# Altium schematic sheet Battery-Charger.SchDoc
size A4; DrawnBy: UGUR KELES; SheetNumber: 2; SheetTotal: 4; Size: A4
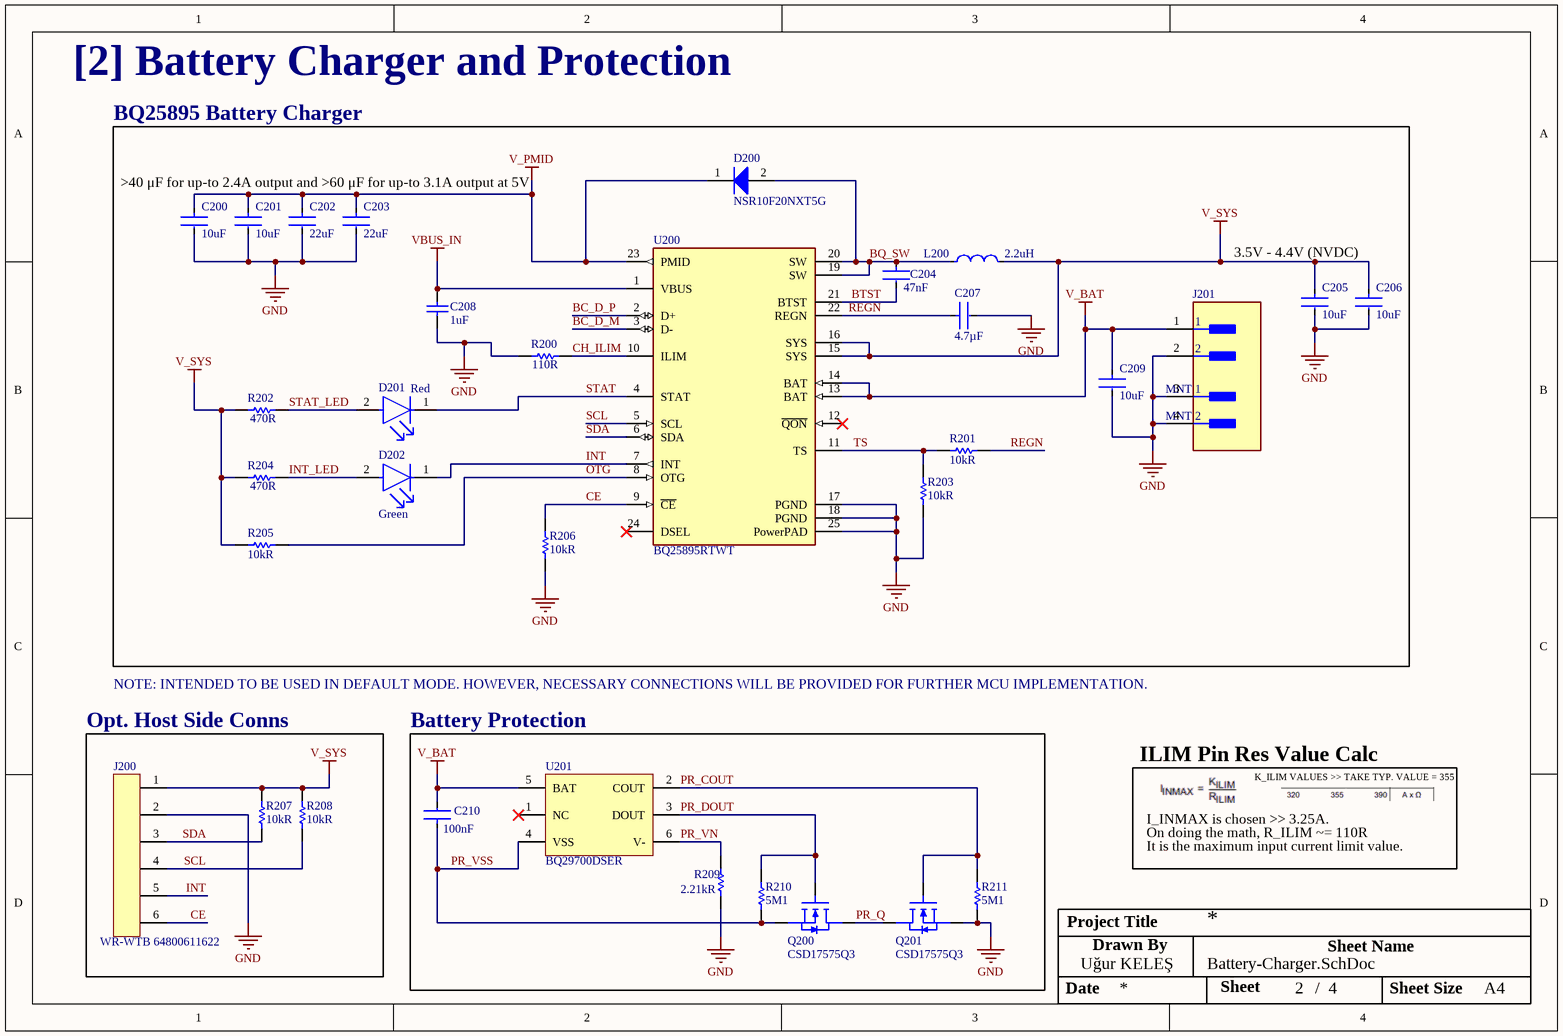
[diagram p0: Battery-Charger.SchDoc]

## Parts
C200  Capacitance: 10uF  [FP-GRM188-0_2-MFG]  (hidden comment: GRM188R61E106MA73D)
C201  Capacitance: 10uF  [FP-GRM188-0_2-MFG]  (hidden comment: GRM188R61E106MA73D)
C202  Capacitance: 22uF  [FP-GRM21B-0_2-e0_2_0_7-IPC_B]  (hidden comment: GRM21BR61E226ME44L)
C203  Capacitance: 22uF  [FP-GRM21B-0_2-e0_2_0_7-IPC_B]  (hidden comment: GRM21BR61E226ME44L)
C204  Capacitance: 47nF  [FP-GRM155-0_05-MFG]  (hidden comment: GRM155R71E473KA88D)
C205  Capacitance: 10uF  [FP-GRM188-0_2-MFG]  (hidden comment: GRM188R61E106MA73D)
C206  Capacitance: 10uF  [FP-GRM188-0_2-MFG]  (hidden comment: GRM188R61E106MA73D)
C207  Capacitance: 4.7µF  [FP-GRM188-0_15-MFG]  (hidden comment: GRM188R61C475KAAJD)
C208  value 1uF  [CAPC2013X95X45NL10T25]  (hidden comment: GRM219R71E105KA88D)
C209  Capacitance: 10uF  [FP-GRM188-0_2-MFG]  (hidden comment: GRM188R61E106MA73D)
C210  Capacitance: 100nF  [FP-GRM155-0_05-IPC_A]  (hidden comment: GRM155R61H104KE19D)
D200  NSR10F20NXT5G  [ONSC-DSN-2-152AC-01_V]
D201  Color: Red  [FP-LTST-C190KRKT-MFG]  (hidden comment: LTST-C190KRKT)
D202  Color: Green  [FP-LTST-C190GKT-MFG]  (hidden comment: LTST-C190GKT)
J200  WR-WTB 64800611622  [6P SMD TERMINAL 1.50 MALE]
J201  B2B-PH-SM4-TBT(LF)(SN)  [FP-B2B-PH-SM4-TBT_LF_SN-MFG]  (value not drawn)
L200  Inductance: 2.2uH  [FP-IHLP-2020BZ-FP_1_905x2-MFG]  (hidden comment: IHLP2020BZER2R2M11)
Q200  CSD17575Q3  [8-PowerTDFN]
Q201  CSD17575Q3  [8-PowerTDFN]
R200  value 110R  [RESC1005X40X25NL05T05]  (hidden comment: CRCW0402110RFKTD)
R201  value 10kR  [RESC1005X40X25ML05T10]  (hidden comment: CRCW040210K0FKEDHP)
R202  value 470R  [RESC1005X40X25ML05T05]  (hidden comment: CRCW0402470RJNED)
R203  value 10kR  [RESC1005X40X25ML05T10]  (hidden comment: CRCW040210K0FKEDHP)
R204  value 470R  [RESC1005X40X25ML05T05]  (hidden comment: CRCW0402470RJNED)
R205  value 10kR  [RESC1005X40X25ML05T10]  (hidden comment: CRCW040210K0FKEDHP)
R206  value 10kR  [RESC1005X40X25ML05T10]  (hidden comment: CRCW040210K0FKEDHP)
R207  value 10kR  [RESC1005X40X25ML05T10]  (hidden comment: CRCW040210K0FKEDHP)
R208  value 10kR  [RESC1005X40X25ML05T10]  (hidden comment: CRCW040210K0FKEDHP)
R209  value 2.21kR  [RESC1005X40X25NL05T05]  (hidden comment: CRCW04022K21FKED)
R210  5M1  [RESC0402(1005)_N]
R211  5M1  [RESC0402(1005)_N]
U200  BQ25895RTWT  [FP-RTW0024H-MFG]
U201  BQ29700DSER  [WSON-8]

## Blocks framed on the sheet
BQ25895 Battery Charger: C200-C209 D200-D202 J201 L200 R200-R206 U200
Opt. Host Side Conns: J200 R207 R208
Battery Protection: C210 Q200 Q201 R209-R211 U201

## Nets
GND: C200.2 C201.2 C202.2 C203.2 C205.2 C206.2 C207.2 C208.1 C209.2 J200.2 J201.2 J201.3(MNT_1) J201.4(MNT_2) Q201.1,_2,_3(S) R200.1 R203.2 R206.2 R209.1 R211.1 U200.17(PGND) U200.18(PGND) U200.25(PowerPAD)
V_BAT: C209.1 C210.2 J201.1 U200.13(BAT) U200.14(BAT) U201.5(BAT)
V_PMID: C200.1 C201.1 C202.1 C203.1 D200.1(K) U200.23(PMID)
V_SYS: C205.1 C206.1 J200.1 L200.2 R202.1 R204.1 R205.2 R207.1 R208.1 U200.15(SYS) U200.16(SYS)
VBUS_IN: C208.2 U200.1(VBUS)
BC_D_M: U200.3(D-)
BC_D_P: U200.2(D+)
BQ_SW: C204.1 D200.2(A) L200.1 U200.19(SW) U200.20(SW)
BTST: C204.2 U200.21(BTST)
CE: J200.6 R206.1 U200.9(~{CE})
CH_ILIM: R200.2 U200.10(ILIM)
INT: D202.1(C) J200.5 U200.7(INT)
INT_LED: D202.2(A) R204.2
OTG: R205.1 U200.8(OTG)
PR_COUT: Q201.4(G) R211.2 U201.2(COUT)
PR_DOUT: Q200.4(G) R210.2 U201.3(DOUT)
PR_Q: Q200.5,_6,_7,_8(D) Q201.5,_6,_7,_8(D)
PR_VN: R209.2 U201.6(V-)
PR_VSS: C210.1 Q200.1,_2,_3(S) R210.1 U201.4(VSS)
REGN: C207.1 R201.2 U200.22(REGN)
SCL: J200.4 R208.2 U200.5(SCL)
SDA: J200.3 R207.2 U200.6(SDA)
STAT: D201.1(C) U200.4(STAT)
STAT_LED: D201.2(A) R202.2
TS: R201.1 R203.1 U200.11(TS)

Not connected (* = marked no-connect by the designer): U200 12(~{QON})* 24(DSEL)*; U201 1(NC)*

## Notes on the sheet
- [2] Battery Charger and Protection
- >40 μF for up-to 2.4A output and >60 μF for up-to 3.1A output at 5V
- 3.5V - 4.4V (NVDC)
- NOTE: INTENDED TO BE USED IN DEFAULT MODE. HOWEVER, NECESSARY CONNECTIONS WILL BE PROVIDED FOR FURTHER MCU IMPLEMENTATION.
- ILIM Pin Res Value Calc
- K_ILIM VALUES >> TAKE TYP. VALUE = 355
- I_INMAX is chosen >> 3.25A.
- On doing the math, R_ILIM ~= 110R
- It is the maximum input current limit value.
- Project Title
- Uğur KELEŞ
- Drawn By
- Sheet Name
- Date
- Sheet
- /
- Sheet Size

## Library data of the parts
C200 C201 C205 C206 C209 = CMP-2006-02520-2: Chip Multilayer Ceramic Capacitors for General Purpose, 0603, 10uF, X5R, 15%, 20%, 25V; Tolerance: 20%; Resistor Type: Ceramic; Voltage: 25V; Max Operating Temperature: 85°C; Min Operating Temperature: -55°C; Dielectric: X5R; Lead Free: Lead Free; REACH SVHC: No SVHC; Case/Package: 0603; Mount: Surface Mount; Voltage Rating (DC): 25V; Height: 0.8mm; Length: 1.6mm; Thickness: 0.031inch; Width: 0.031inch; Termination: SMD/SMT; Case Code (Imperial): 0603; Case Code (Metric): 1608; Package Quantity: 1; Packaging: Tape and Reel; Depth: 0.8mm; Voltage Rating: 25V; Weight: 0.000222oz; Number of Pins: 2
C202 C203 = CMP-2007-03222-3: Chip Multilayer Ceramic Capacitors for General Purpose, 0805, 22uF, X5R, 15%, 20%, 25V; Case/Package: 0805; Depth: 1.25mm; Resistor Type: Ceramic; Voltage Rating: 25V; Lead Free: Lead Free; Voltage Rating (DC): 25V; Case Code (Metric): 2012; Thickness: 0.057inch; REACH SVHC: No SVHC; Material: Ceramic; Tolerance: 20%; Length: 2mm; Case Code (Imperial): 0805; Max Operating Temperature: 85°C; Termination: SMD/SMT; Weight: 0.000335oz; Dielectric: X5R; Packaging: Tape and Reel; Voltage: 25V; Package Quantity: 3000; Height: 1.25mm; Mount: Surface Mount; Width: 1.25mm; Min Operating Temperature: -55°C
C204 = CMP-2008-04630-5: Chip Multilayer Ceramic Capacitors for General Purpose, 0402, 47000pF, X7R, 15%, 10%, 25V; Depth: 0.5mm; Case/Package: 0402; Tolerance: 10%; REACH SVHC: No SVHC; Termination: SMD/SMT; Number of Pins: 2; Mount: Surface Mount; Radiation Hardening: No; Height: 0.5mm; Min Operating Temperature: -55°C; Max Operating Temperature: 125°C; Thickness: 0.022inch; Length: 1mm; Voltage Rating (DC): 25V; Material: Ceramic; Lead Free: Lead Free; Packaging: Tape and Reel; Dielectric: X7R; Voltage: 25V; Case Code (Metric): 1005; Width: 0.02inch; Case Code (Imperial): 0402; Voltage Rating: 25V; Package Quantity: 1
C207 = CMP-06035-062935-2: CAP CER 4.7UF 16V X5R 0603; NexarPartId: 20311162; Material: Ceramic; Tolerance: 10%; Lead Free: Lead Free; Weight: 6.293594mg; Max Operating Temperature: 85°C; Thickness: 939.8µm; RoHS: Compliant; Case Code (Imperial): 0603; Case Code (Metric): 1608; Depth: 800µm; Schedule B: 8532240020; Width: 800µm; Lifecycle Status: Production; Voltage Rating: 16V; REACH SVHC: No SVHC; Height: 800µm; Case/Package: 0603; Voltage Rating (DC): 16V; Mount: Surface Mount; Dielectric: X5R; Termination: SMD/SMT; Packaging: Tape & Reel (TR); Length: 1.6mm; Min Operating Temperature: -55°C
C208 = CMP-1036-04754-2: Manufacturer: Murata; Dielectric Material: Ceramic; Multilayer: Yes; Tolerance  (fill in as +-): 10%; Rated DC Voltage (URdc): 25V; Temperature Characteristics Code: X7R; Part Number: GRM219R71E105KA88D; Supplier: Arrow Electronics; Supplier Part Number: GRM219R71E105KA88D; Manufacturer Part Number: GRM219R71E105KA88D; RoHS: Yes; Category: Ceramic Capacitors; Stock: 13294; Pricing: 2500=0,04, 3000=0,0318, 6000=0,0279 (USD); Mounting Technology: Surface Mount; Pins: 2; Package Shape: Rectangular; Case/Package: 0805; Terminal Finish: Nickel; Min Operating Temperature: -55°C; Max Operating Temperature: 125°C; JESD-609 Code: e3; Capacitor Type: Ceramic; Package Style: SMTMeter; Packaging: Tape and Reel; Tolerance (fill in as +-): 10%; Termination: Wraparound; Length: 2mm; Width: 1.25mm; Height: 0.85mm; Reach SVHC Compliant: Yes; RoHS Compliant: Yes; ComponentLink1URL: https://datasheet.ciiva.com:443/pdfs/VipMasterIC/IC/MURE/MURE-S-A0004349797/MURE-S-A0004361422-1.pdf?src-supplier=IHS+Markit; ComponentLink1Description: https://datasheet.ciiva.com:443/pdfs/VipMasterIC/IC/MURE/MURE-S-A0004349797/MURE-S-A0004361422-1.pdf?src-supplier=IHS+Markit; ComponentLink2URL: https://datasheet.ciiva.com/22703/1747466-22703351.pdf?src-supplier=Element14; ComponentLink2Description: https://datasheet.ciiva.com/22703/1747466-22703351.pdf?src-supplier=Element14; ComponentLink3URL: https://datasheet.ciiva.com/6256/partnumbering-e-01-6256413.pdf?src-supplier=Digikey; ComponentLink3Description: https://datasheet.ciiva.com/6256/partnumbering-e-01-6256413.pdf?src-supplier=Digikey; ComponentLink4URL: https://datasheet.ciiva.com/6256/partnumbering-e-01-6256412.pdf?src-supplier=Digikey; ComponentLink4Description: https://datasheet.ciiva.com/6256/partnumbering-e-01-6256412.pdf?src-supplier=Digikey; ComponentLink5URL: https://datasheet.ciiva.com/6256/partnumbering-e-01-6256414.pdf?src-supplier=Digikey; ComponentLink5Description: https://datasheet.ciiva.com/6256/partnumbering-e-01-6256414.pdf?src-supplier=Digikey; ComponentLink6URL: https://datasheet.ciiva.com/11464/product-11464043.pdf?src-supplier=Avnet; ComponentLink6Description: https://datasheet.ciiva.com/11464/product-11464043.pdf?src-supplier=Avnet
C210 = CMP-2008-04108-2: Chip Multilayer Ceramic Capacitors for General Purpose, 0402, 0.10uF, X5R, 15%, 10%, 50V; Case/Package: 0402; Voltage: 50V; Dielectric: X5R; Height: 0.5mm; Case Code (Metric): 1005; Length: 1mm; Width: 0.02inch; Mount: Surface Mount; Case Code (Imperial): 0402; Lead Free: Lead Free; Depth: 0.5mm; Max Operating Temperature: 85°C; Tolerance: 10%; Voltage Rating (DC): 50V; Packaging: Tape and Reel; REACH SVHC: No SVHC; Voltage Rating: 50V; Min Operating Temperature: -55°C; Thickness: 0.022inch
D200 = CMP-1055-00230-1: Schottky Barrier Diode, 2-Pin DSN, Pb-Free, Tape and Reel; Manufacturer: On Semiconductor; Configuration: Single; IFSM Max (A): 18; ComponentLink3Description: Package Specification; ComponentLink1URL: http://www.onsemi.com/; PackageReference: DSN-2-152AC-01; ComponentLink2URL: http://www.onsemi.com/pub_link/Collateral/NSR10F20-D.PDF; RoHS: TRUE; ComponentLink2Description: Datasheet; PackageDescription: 2-Pin Micro Molded Package, Body 1 x 0.6 mm; Mounting Technology: Surface Mount; ComponentLink3URL: http://www.onsemi.cn/pub_link/Collateral/152AC.PDF; PartNumber: NSR10F20NXT5G; ComponentLink1Description: Manufacturer URL; Packing: Tape and Reel; PackageVersion: Rev. C, 01/2011; DatasheetVersion: Rev. 2
D201 = CMP-1674-00011-2: LED RED CLEAR CHIP SMD; Reverse Voltage: 5V; Viewing Angle: 130°; Power Rating: 75mW; Test Current: 20mA; Number of Elements: 1; Lens Color: Colorless; Wavelength: 639nm; Dominant Wavelength: 631nm; Lens Style: Diffused; Forward Current: 30mA; Forward Voltage: 2.4V; Luminous Intensity: 54mcd; Case Code (Imperial): 0603; Lens Transparency: Clear; Lead Free: Lead Free; Package Quantity: 1; Packaging: Tape and Reel; Max Operating Temperature: 85°C; Number of Pins: 2; Height: 0.8mm; Case/Package: 0603; Number of LEDs: 1; Width: 0.8mm; Case Code (Metric): 1608; Depth: 0.8mm; Mount: Surface Mount; Radiation Hardening: No; Length: 1.6mm; Illumination Color: Red; Power Dissipation: 75mW; Min Operating Temperature: -55°C
D202 = CMP-22017-000005-2: LED GREEN CLEAR CHIP SMD; Dominant Wavelength: 569nm; Reverse Voltage: 5V; Lens Color: Colorless; Viewing Angle: 130°; Voltage: 2V; Forward Current: 30mA; Power Dissipation: 100mW; Luminous Intensity: 6mcd; Number of LEDs: 1; Forward Voltage: 2.1V; Wavelength: 565nm; Test Current: 10mA; Min Operating Temperature: -55°C; Lens Style: Clear; Mount: Surface Mount; Width: 0.8mm; Packaging: Tape and Reel; Lens Transparency: Clear; Case Code (Metric): 1608; Depth: 0.8mm; Case Code (Imperial): 0603; Case/Package: 0603; Number of Pins: 2; Max Operating Temperature: 85°C; Lead Free: Lead Free; Number of Elements: 1; Length: 1.6mm; Height: 0.8mm; Package Quantity: 1; Power Rating: 100mW; Radiation Hardening: No; Illumination Color: Green
J200 = 6P SMD TERMINAL 1.50 MALE: WR-WTB Wire-to-Board Connectors 1.50 mm; Manufacturer: Wurth Electronics; Designed by: UK; Supplier: Digikey; Supplier Part Number: 732-64800611622-ND; Manufacturer Part Number: 64800611622; RoHS: No; Category: Uncategorized; Stock: 1319; Pricing: 1=0.42, 50=0.406, 100=0.384, 250=0.361, 500=0.339 (USD)
J201 = CMP-17439-000005-1: CONN HEADER SMD 2POS 2MM; Manufacturer: JST; Current Rating: 2A; Conn Gender: Male; Voltage Rating: 100V; Conn Orientation: Vertical; Number Of Contacts: 2; Octopart: https://octopart.com/b2b-ph-sm4-tbt%28lf%29%28sn%29-jst-7877930; Number Of Rows: 1; Device Class L2: Headers and Wire Housings; RoHS: TRUE; Contact Material: Tin,Copper; Height: 6.65mm; Temperature: -25°C to +85°C; Temperature Range Low: -25°C; ComponentLink2Description: Datasheet; Manufacturer Part Number: B2B-PH-SM4-TBT(LF)(SN); ComponentLink2URL: http://www.jst-mfg.com/product/pdf/eng/ePH.pdf; Automotive: No; Pitch: 2mm; Lead Free: Yes; Device Class L3: unset; Category: Conn; Digikey Description: CONN HEADER SMD 2POS 2MM; Temperature Range High: +85°C; Package: 0; Device Class L1: Connectors
L200 = CMP-02424-000260-1: Fixed Inductors Commercial Low DCR Series 2.2uH 5A 37.7mΩ 20%; Test Frequency: 100kHz; Self Resonant Frequency: 41MHz; Shielding: Shielded; Saturation Current: 5.5A; DC Resistance (DCR): 37.7mR; Core Material: Metal; RMS Current (Irms): 5A; Case/Package: 2020; Width: 0.204inch; Height - Seated (Max): 0.079inch; Package Quantity: 2000; Length: 5.74mm; Inductance Tolerance: 20%; Tolerance: 20%; Height: 2mm; Min Operating Temperature: -55°C; Termination: SMD/SMT; Current Rating: 5A; Mount: Surface Mount; Max DC Current: 5.5A; Packaging: Tape and Reel; Number of Pins: 2; Max Operating Temperature: 125°C; Depth: 5.43mm; Military Standard: Not; Radiation Hardening: No; Contact Plating: Tin; Lead Free: Lead Free
Q200 Q201 = CSD17575Q3: Power Field-Effect Transistor, 27A I(D), 30V, 0.0032ohm, 1-Element, N-Channel, Silicon, Metal-oxide Semiconductor FET; pin to pad: 1, 2, 3>1+2+3 5, 6, 7>5+6 5, 6, 7, 8>5+6+7+8; Manufacturer: Texas Instruments; Package Body Material: Plastic; Avalanche Energy Rating (Eas): 115mJ; Case Connection: DRAIN; Drain-source On Resistance-Max: 3.2mR; Number of Elements: 1; Operating Mode: ENHANCEMENT MODE; Pulsed Drain Current-Max (IDM): 240A; Transistor Application: SWITCHING; Supplier: Mouser; Supplier Part Number: 595-CSD17575Q3; Manufacturer Part Number: CSD17575Q3; RoHS: Yes; Category: MOSFETs; Stock: 78535; Pricing: 1=1,29, 10=0,848, 50=0,848, 100=0,605, 1000=0,423, 10000=0,351 (USD); Pins: 5; Package Shape: Square; Terminal Finish: Tin; Transistor Element Material: SILICON; JESD-609 Code: e3; Polarity/Channel Type: N-CHANNEL; Drain Current-Max (ID): 27A; DS Breakdown Voltage-Min: 30V; FET Technology: METAL-OXIDE SEMICONDUCTOR; Moisture Sensitivity Level: 1; Package Style: SMALL OUTLINEMeter; Peak Reflow Temperature (Cel): 260°C; Surface Mount: Yes; Terminal Form: No Lead; Terminal Position: DUAL; RoHS Compliant: Yes; Reach SVHC Compliant: No; ComponentLink1URL: https://www.ti.com:443/lit/ds/symlink/csd17575q3.pdf?src-supplier=IHS+Markit; ComponentLink1Description: https://www.ti.com:443/lit/ds/symlink/csd17575q3.pdf?src-supplier=IHS+Markit; ComponentLink2URL: http://www.ti.com/lit/gpn/csd17575q3?src-supplier=Mouser; ComponentLink2Description: http://www.ti.com/lit/gpn/csd17575q3?src-supplier=Mouser; ComponentLink3URL: http://www.ti.com/lit/ds/symlink/csd17575q3.pdf?src-supplier=Digikey; ComponentLink3Description: http://www.ti.com/lit/ds/symlink/csd17575q3.pdf?src-supplier=Digikey; ComponentLink4URL: http://www.ti.com/general/docs/lit/getliterature.tsp?genericPartNumber=CSD17575Q3&&fileType=pdf&src-supplier=Avnet; ComponentLink4Description: http://www.ti.com/general/docs/lit/getliterature.tsp?genericPartNumber=CSD17575Q3&&fileType=pdf&src-supplier=Avnet
R200 = CMP-2002-00387-1: Manufacturer: Vishay Dale; Tolerance: 1%; Power: 63mW; Rated Temperature: 70°C; Working Voltage: 50V; Temperature Coefficient (ppm/Cel): 100; Package Height: 0.35mm; Package Length: 1mm; Package Width: 0.5mm; Reference Standard: AEC-Q200; Part Number: CRCW0402110RFKTD; Supplier: Mouser; Supplier Part Number: 71-CRCW0402-110; Manufacturer Part Number: CRCW0402110RFKTD; RoHS: No; Category: Chip SMD Resistors; Stock: 28266; Pricing: 1=0,15, 10=0,076, 50=0,076, 100=0,043, 1000=0,027, 10000=0,023 (USD); Mounting Technology: Surface Mount; Pins: 2; Package Shape: Rectangular; Case/Package: 0402; Terminal Finish: Nickel; Min Operating Temperature: -55°C; Max Operating Temperature: 155°C; JESD-609 Code: e0; Resistor Type: FIXED RESISTOR; Construction: Chip; Packaging: Tape and Reel; Technology: METAL GLAZE/THICK FILM; Termination: Wraparound; RoHS Compliant: No; Reach SVHC Compliant: No; ComponentLink1URL: https://datasheet.ciiva.com:443/pdfs/VipMasterIC/IC/VISH/VISH-S-A0002183699/VISH-S-A0002183699-1.pdf?src-supplier=IHS+Markit; ComponentLink1Description: https://datasheet.ciiva.com:443/pdfs/VipMasterIC/IC/VISH/VISH-S-A0002183699/VISH-S-A0002183699-1.pdf?src-supplier=IHS+Markit; ComponentLink2URL: https://datasheet.ciiva.com/2563/dcrcw-2563028.pdf?src-supplier=Digikey; ComponentLink2Description: https://datasheet.ciiva.com/2563/dcrcw-2563028.pdf?src-supplier=Digikey; ComponentLink3URL: https://datasheet.ciiva.com/8977/dcrcw-8977478.pdf?src-supplier=Avnet; ComponentLink3Description: https://datasheet.ciiva.com/8977/dcrcw-8977478.pdf?src-supplier=Avnet
R201 R203 R205-R208 = CMP-2002-03043-1: Manufacturer: Vishay Dale; Tolerance: 1%; Power: 200mW; Working Voltage: 50V; Temperature Coefficient (ppm/Cel): 100; Rated Temperature: 70°C; Package Height: 0.3mm; Package Length: 1mm; Package Width: 0.5mm; Reference Standard: AEC-Q200; Part Number: CRCW040210K0FKEDHP; Supplier: Mouser; Supplier Part Number: 71-CRCW040210K0FKEDH; Manufacturer Part Number: CRCW040210K0FKEDHP; RoHS: Yes; Category: Chip SMD Resistors; Stock: 170765; Pricing: 1=0,11, 10=0,035, 50=0,035, 100=0,02, 1000=0,016, 10000=0,012 (USD); Mounting Technology: Surface Mount; Pins: 2; Case/Package: 0402; Terminal Finish: Nickel; Package Shape: Rectangular; Min Operating Temperature: -55°C; Max Operating Temperature: 155°C; JESD-609 Code: e3; Resistor Type: FIXED RESISTOR; Construction: Chip; Packaging: Tape and Reel; Technology: METAL GLAZE/THICK FILM; Termination: Wraparound; Reach SVHC Compliant: Yes; RoHS Compliant: Yes; ComponentLink1URL: https://datasheet.ciiva.com:443/pdfs/VipMasterIC/IC/VISH/VISH-S-A0009391795/VISH-S-A0009391795-1.pdf?src-supplier=IHS+Markit; ComponentLink1Description: https://datasheet.ciiva.com:443/pdfs/VipMasterIC/IC/VISH/VISH-S-A0009391795/VISH-S-A0009391795-1.pdf?src-supplier=IHS+Markit; ComponentLink2URL: https://datasheet.ciiva.com/7725/crcwhpe3-7725759.pdf?src-supplier=Element14; ComponentLink2Description: https://datasheet.ciiva.com/7725/crcwhpe3-7725759.pdf?src-supplier=Element14; ComponentLink3URL: https://datasheet.ciiva.com/28588/1750852-28588877.pdf?src-supplier=Element14; ComponentLink3Description: https://datasheet.ciiva.com/28588/1750852-28588877.pdf?src-supplier=Element14; ComponentLink4URL: https://datasheet.ciiva.com/5550/crcwhpe3-46056-5550367.pdf?src-supplier=Mouser; ComponentLink4Description: https://datasheet.ciiva.com/5550/crcwhpe3-46056-5550367.pdf?src-supplier=Mouser; ComponentLink5URL: https://datasheet.ciiva.com/9052/crcwhpe3-9052616.pdf?src-supplier=Avnet; ComponentLink5Description: https://datasheet.ciiva.com/9052/crcwhpe3-9052616.pdf?src-supplier=Avnet
R202 R204 = CMP-2002-00023-1: Manufacturer: Vishay Dale; Tolerance: 5%; Power: 63mW; Rated Temperature: 70°C; Working Voltage: 50V; Temperature Coefficient (ppm/Cel): 200; Package Height: 0.35mm; Package Length: 1mm; Package Width: 0.5mm; Reference Standard: AEC-Q200; Part Number: CRCW0402470RJNED; Supplier: Mouser; Supplier Part Number: 71-CRCW0402J-470-E3; Manufacturer Part Number: CRCW0402470RJNED; RoHS: Yes; Category: Chip SMD Resistors; Stock: 14579; Pricing: 1=0,1, 10=0,015, 50=0,015, 100=0,009, 1000=0,008, 10000=0,004 (USD); Mounting Technology: Surface Mount; Pins: 2; Package Shape: Rectangular; Terminal Finish: Nickel; Case/Package: 0402; Min Operating Temperature: -55°C; Max Operating Temperature: 155°C; JESD-609 Code: e3; Technology: METAL GLAZE/THICK FILM; Resistor Type: FIXED RESISTOR; Construction: Chip; Packaging: Tape and Reel; Termination: Wraparound; Reach SVHC Compliant: Yes; RoHS Compliant: Yes; ComponentLink1URL: https://datasheet.ciiva.com:443/pdfs/VipMasterIC/IC/VISH/VISH-S-A0007266705/VISH-S-A0007266705-1.pdf?src-supplier=IHS+Markit; ComponentLink1Description: https://datasheet.ciiva.com:443/pdfs/VipMasterIC/IC/VISH/VISH-S-A0007266705/VISH-S-A0007266705-1.pdf?src-supplier=IHS+Markit; ComponentLink2URL: https://datasheet.ciiva.com/2461/dcrcwe3-2461993.pdf?src-supplier=Digikey; ComponentLink2Description: https://datasheet.ciiva.com/2461/dcrcwe3-2461993.pdf?src-supplier=Digikey; ComponentLink3URL: https://datasheet.ciiva.com/2461/dcrcwe3-2461994.pdf?src-supplier=Digikey; ComponentLink3Description: https://datasheet.ciiva.com/2461/dcrcwe3-2461994.pdf?src-supplier=Digikey; ComponentLink4URL: https://datasheet.ciiva.com/3256/dcrcwe3-3256554.pdf?src-supplier=Avnet; ComponentLink4Description: https://datasheet.ciiva.com/3256/dcrcwe3-3256554.pdf?src-supplier=Avnet; ComponentLink5URL: https://datasheet.ciiva.com/8336/dcrcwe3-8336717.pdf?src-supplier=Avnet; ComponentLink5Description: https://datasheet.ciiva.com/8336/dcrcwe3-8336717.pdf?src-supplier=Avnet; ComponentLink6URL: https://datasheet.ciiva.com/2461/dcrcwe3-2461992.pdf?src-supplier=Digikey; ComponentLink6Description: https://datasheet.ciiva.com/2461/dcrcwe3-2461992.pdf?src-supplier=Digikey; ComponentLink7URL: https://datasheet.ciiva.com/28571/1847332-28571880.pdf?src-supplier=Element14; ComponentLink7Description: https://datasheet.ciiva.com/28571/1847332-28571880.pdf?src-supplier=Element14; ComponentLink8URL: https://datasheet.ciiva.com/5550/dcrcwe3-109170-5550440.pdf?src-supplier=Mouser; ComponentLink8Description: https://datasheet.ciiva.com/5550/dcrcwe3-109170-5550440.pdf?src-supplier=Mouser
R209 = CMP-2002-08454-1: Manufacturer: Vishay Dale; Tolerance: 1%; Power: 63mW; Working Voltage: 50V; Temperature Coefficient (ppm/Cel): 100; Rated Temperature: 70°C; Package Height: 0.35mm; Package Length: 1mm; Package Width: 0.5mm; Reference Standard: AEC-Q200; Part Number: CRCW04022K21FKED; Supplier: Mouser; Supplier Part Number: 71-CRCW0402-2.21K-E3; Manufacturer Part Number: CRCW04022K21FKED; RoHS: Yes; Category: Chip SMD Resistors; Stock: 121652; Pricing: 1=0,1, 10=0,017, 50=0,017, 100=0,013, 1000=0,008, 10000=0,004 (USD); Mounting Technology: Surface Mount; Pins: 2; Case/Package: 0402; Terminal Finish: Nickel; Package Shape: Rectangular; Min Operating Temperature: -55°C; Max Operating Temperature: 155°C; JESD-609 Code: e3; Resistor Type: FIXED RESISTOR; Construction: Chip; Packaging: Tape and Reel; Technology: METAL GLAZE/THICK FILM; Termination: Wraparound; Reach SVHC Compliant: Yes; RoHS Compliant: Yes; ComponentLink1URL: https://datasheet.ciiva.com:443/pdfs/VipMasterIC/IC/VISH/VISH-S-A0007266705/VISH-S-A0007266705-1.pdf?src-supplier=IHS+Markit; ComponentLink1Description: https://datasheet.ciiva.com:443/pdfs/VipMasterIC/IC/VISH/VISH-S-A0007266705/VISH-S-A0007266705-1.pdf?src-supplier=IHS+Markit; ComponentLink2URL: https://datasheet.ciiva.com/11818/0900766b80d98824-11818019.pdf?src-supplier=Rs; ComponentLink2Description: https://datasheet.ciiva.com/11818/0900766b80d98824-11818019.pdf?src-supplier=Rs; ComponentLink3URL: https://datasheet.ciiva.com/7673/1697337-7673446.pdf?src-supplier=Element14; ComponentLink3Description: https://datasheet.ciiva.com/7673/1697337-7673446.pdf?src-supplier=Element14; ComponentLink4URL: https://datasheet.ciiva.com/16207/dcrcwe3-16207125.pdf?src-supplier=Future+Electronics; ComponentLink4Description: https://datasheet.ciiva.com/16207/dcrcwe3-16207125.pdf?src-supplier=Future+Electronics; ComponentLink5URL: https://datasheet.ciiva.com/3256/dcrcwe3-3256344.pdf?src-supplier=Avnet; ComponentLink5Description: https://datasheet.ciiva.com/3256/dcrcwe3-3256344.pdf?src-supplier=Avnet; ComponentLink6URL: https://datasheet.ciiva.com/2463/dcrcwe3-2463412.pdf?src-supplier=Digikey; ComponentLink6Description: https://datasheet.ciiva.com/2463/dcrcwe3-2463412.pdf?src-supplier=Digikey; ComponentLink7URL: https://datasheet.ciiva.com/3256/dcrcwe3-3256345.pdf?src-supplier=Avnet; ComponentLink7Description: https://datasheet.ciiva.com/3256/dcrcwe3-3256345.pdf?src-supplier=Avnet; ComponentLink8URL: https://datasheet.ciiva.com/15159/getdatasheetpartid-33142-15159405.pdf?src-supplier=Verical; ComponentLink8Description: https://datasheet.ciiva.com/15159/getdatasheetpartid-33142-15159405.pdf?src-supplier=Verical; ComponentLink9URL: https://datasheet.ciiva.com/2463/dcrcwe3-2463413.pdf?src-supplier=Digikey; ComponentLink9Description: https://datasheet.ciiva.com/2463/dcrcwe3-2463413.pdf?src-supplier=Digikey; ComponentLink10URL: https://datasheet.ciiva.com/2463/dcrcwe3-2463414.pdf?src-supplier=Digikey; ComponentLink10Description: https://datasheet.ciiva.com/2463/dcrcwe3-2463414.pdf?src-supplier=Digikey
R210 R211 = CMP-1011-00929-1: 5M1 0.063W 1% 0402 (1005 Metric)  SMD; Case-EIA: 0402; Value: 5100000.00 Ohm; Case-Metric: 1005; Power: 0.063 W; Technology: SMT; Tolerance: 1 %
U200 = CMP-04911-000069-1: IC BATT CHG LI-ION 1CELL 24WQFN; Interface: I2C; Number of Cells: 1; Fault Protection: Over Temperature; Max Charge Current: 5A; Max Supply Voltage: 14V; Output Voltage: 4.6V; Max Operating Temperature: 85°C; Contact Plating: Gold; REACH SVHC: No SVHC; Number of Pins: 24; RoHS Compliant: Yes; Packaging: Cut Tape; Lead Free: Lead Free; Mount: Surface Mount; Min Operating Temperature: -40°C; Output Current: 5A
U201 = BQ29700DSER: Power Supply Support Circuit, Fixed, 1 Channel, PDSO6; Manufacturer: Texas Instruments; Designed by: UK; Package Body Material: Plastic; Adjustable Threshold: No; Number of Channels: 1; Max Supply Voltage: 8V; Min Supply Voltage: 1.5V; Nominal Supply Voltage: 3.6V; Supplier: Mouser; Supplier Part Number: 595-BQ29700DSER; Manufacturer Part Number: BQ29700DSER; RoHS: Yes; Category: Battery Management; Stock: 16041; Pricing: 1=0,42, 10=0,301, 50=0,301, 100=0,247, 1000=0,232, 10000=0,208 (USD); Case/Package: VSON; Pins: 6; Package Shape: Square; Terminal Finish: Nickel; Min Operating Temperature: -40°C; Max Operating Temperature: 85°C; JESD-609 Code: e4; Throw Configuration: POWER SUPPLY SUPPORT CIRCUIT; JESD-30 Code: S-PDSO-N6; Moisture Sensitivity Level: 1; Channels: 1; Package Style: SMALL OUTLINE, VERY THIN PROFILEMeter; Peak Reflow Temperature (Cel): 260°C; Surface Mount: Yes; Terminal Form: No Lead; Terminal Position: DUAL; Length: 1.5mm; Width: 1.5mm; Height - Seated (Max): 0.8mm; Terminal Pitch: 0.5mm; Temperature Grade: INDUSTRIAL; Reach SVHC Compliant: Yes; RoHS Compliant: Yes; ComponentLink1URL: https://www.ti.com:443/lit/ds/symlink/bq2970.pdf?src-supplier=IHS+Markit; ComponentLink1Description: https://www.ti.com:443/lit/ds/symlink/bq2970.pdf?src-supplier=IHS+Markit; ComponentLink2URL: http://www.ti.com/lit/ds/symlink/bq2971.pdf?src-supplier=Digikey; ComponentLink2Description: http://www.ti.com/lit/ds/symlink/bq2971.pdf?src-supplier=Digikey; ComponentLink3URL: http://www.ti.com/general/docs/lit/getliterature.tsp?genericPartNumber=BQ2970&&fileType=pdf&src-supplier=Avnet; ComponentLink3Description: http://www.ti.com/general/docs/lit/getliterature.tsp?genericPartNumber=BQ2970&&fileType=pdf&src-supplier=Avnet; ComponentLink4URL: http://www.ti.com/lit/gpn/bq2970?src-supplier=Mouser; ComponentLink4Description: http://www.ti.com/lit/gpn/bq2970?src-supplier=Mouser